# Altium schematic sheet user.SchDoc
size A3
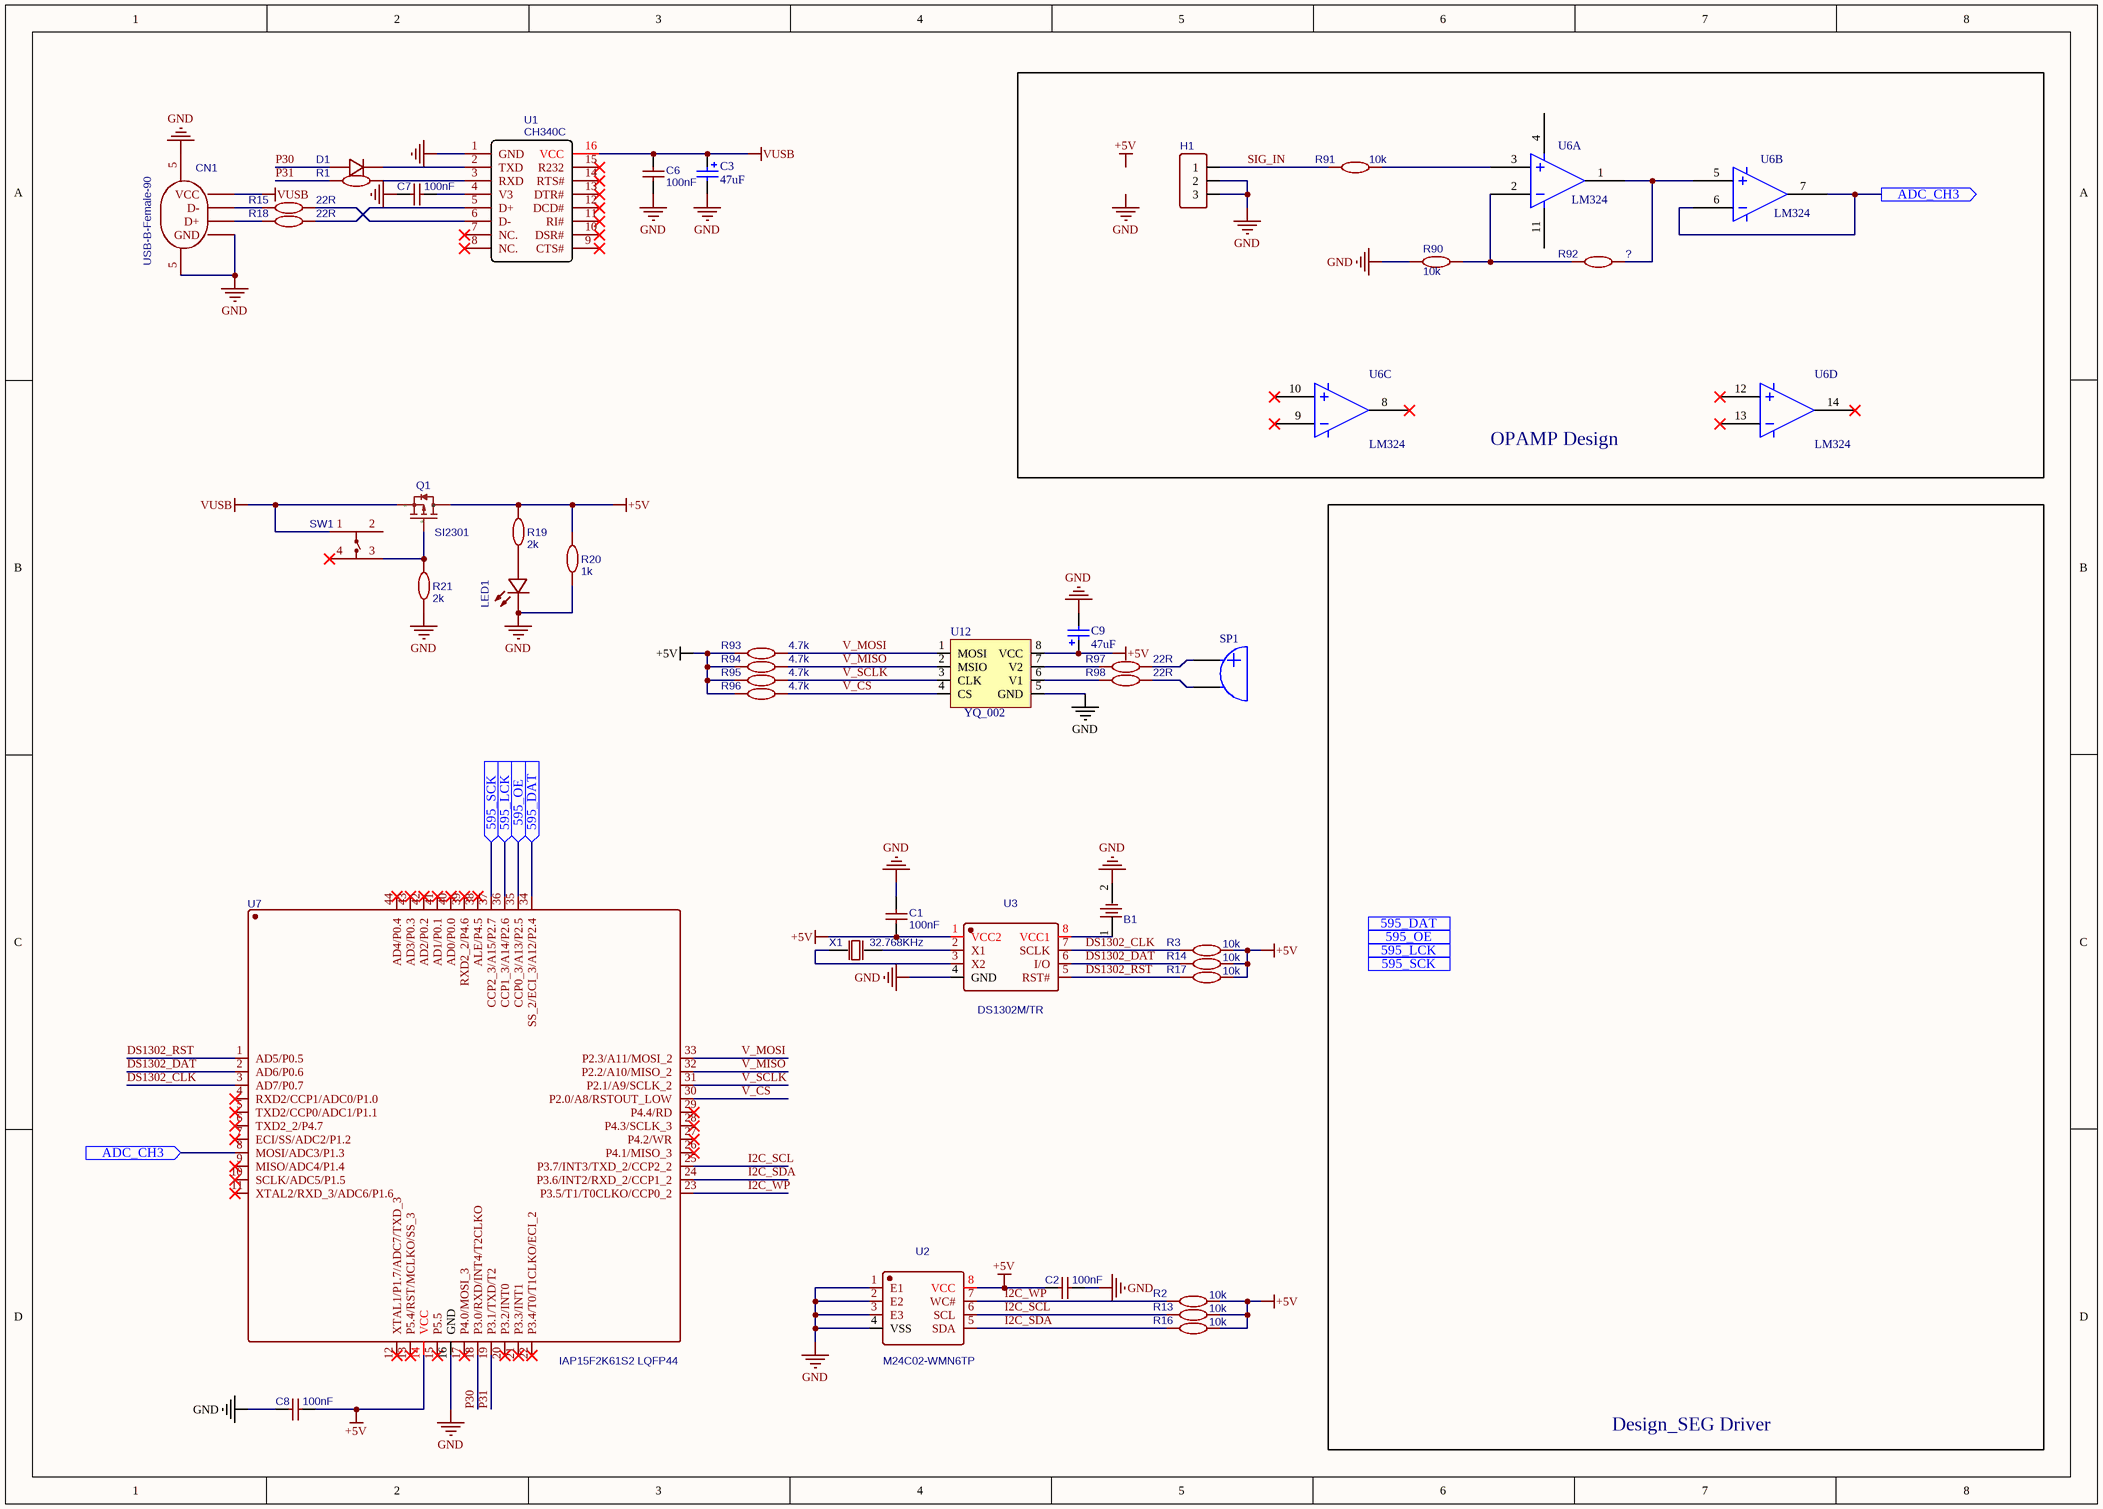
[diagram p0: user.SchDoc]

## Parts
B1  CR1220-2  (value not drawn)
C1  100nF
C2  100nF
C3  47uF
C6  100nF
C7  100nF
C8  100nF
C9  47uF
CN1  USB-B-Female-90
D1  KLL4148  (value not drawn)
H1  HDR-F-2.54_1x3  (value not drawn)
LED1  17-21URC/TR8  (value not drawn)
Q1  SI2301
R1  1k  (value not drawn)
R2  10k
R3  10k
R13  10k
R14  10k
R15  22R
R16  10k
R17  10k
R18  22R
R19  2k
R20  1k
R21  2k
R90  10k
R91  10k
R92  ?
R93  4.7k
R94  4.7k
R95  4.7k
R96  4.7k
R97  22R
R98  22R
SP1  BUZZER  (value not drawn)
SW1  TS-1159UB-B-D-BL  (value not drawn)
U1  CH340C
U2  M24C02-WMN6TP
U3  DS1302M/TR
U6  LM324  (parts A,B,C,D of 4)
U7  IAP15F2K61S2 LQFP44
U12  YQ_002
X1  32.768KHz

## Blocks framed on the sheet
OPAMP Design: H1 R90-R92 U6

## Ports
595_DAT (in), 595_DAT (out), 595_LCK (in), 595_LCK (out), 595_OE (in), 595_OE (out), 595_SCK (in), 595_SCK (out), ADC_CH3 (in), ADC_CH3 (out)

## Nets
+5V: C1.1 C2.1 C8.2 C9.1 Q1.3(D) R2.2 R3.2 R13.2 R14.2 R16.2 R17.2 R19.2 R20.2 R93.2 R94.2 R95.2 R96.2 U2.8(VCC) U3.1(VCC2) U7.14(VCC) U12.8(VCC)
GND: B1.2 C1.2 C2.2 C3.2 C6.1 C7.1 C8.1 C9.2 CN1.4(GND) CN1.5(SH1) H1.2 H1.3 LED1.2(K) R20.1 R21.1 R90.2 U1.1(GND) U2.1(E1) U2.2(E2) U2.3(E3) U2.4(VSS) U3.4(GND) U7.16(GND) U12.5(GND)
VUSB: C3.1 C6.2 CN1.1(VCC) Q1.2(S) SW1.1 U1.16(VCC)
595_DAT: U7.34(SS_2/ECI_3/A12/P2.4) ; port 595_DAT
595_LCK: U7.36(CCP1_3/A14/P2.6) ; port 595_LCK
595_OE: U7.35(CCP0_3/A13/P2.5) ; port 595_OE
595_SCK: U7.37(CCP2_3/A15/P2.7) ; port 595_SCK
ADC_CH3: U6.6 U6.7 U7.8(MOSI/ADC3/P1.3) ; port ADC_CH3
DS1302_CLK: R3.1 U3.7(SCLK) U7.3(AD7/P0.7)
DS1302_DAT: R14.1 U3.6(I/O) U7.2(AD6/P0.6)
DS1302_RST: R17.1 U3.5(RST#) U7.1(AD5/P0.5)
I2C_SCL: R13.1 U2.6(SCL) U7.25(P3.7/INT3/TXD_2/CCP2_2)
I2C_SDA: R16.1 U2.5(SDA) U7.24(P3.6/INT2/RXD_2/CCP1_2)
I2C_WP: R2.1 U2.7(WC#) U7.23(P3.5/T1/T0CLKO/CCP0_2)
P30: D1.2(A) U7.18(P3.0/RXD/INT4/T2CLKO)
P31: R1.2 U7.19(P3.1/TXD/T2)
SIG_IN: H1.1 R91.2
V_CS: R96.1 U7.30(P2.0/A8/RSTOUT_LOW) U12.4(CS)
V_MISO: R94.1 U7.32(P2.2/A10/MISO_2) U12.2(MSIO)
V_MOSI: R93.1 U7.33(P2.3/A11/MOSI_2) U12.1(MOSI)
V_SCLK: R95.1 U7.31(P2.1/A9/SCLK_2) U12.3(CLK)
NetB1_1: B1.1 U3.8(VCC1)
NetC7_2: C7.2 U1.4(V3)
NetCN1_2: CN1.2(D-) R15.2
NetCN1_3: CN1.3(D+) R18.2
NetD1_1: D1.1(C) U1.2(TXD)
NetLED1_1: LED1.1(A) R19.1
NetQ1_1: Q1.1(G) R21.2 SW1.3
NetR1_1: R1.1 U1.3(RXD)
NetR15_1: R15.1 U1.6(D-)
NetR18_1: R18.1 U1.5(D+)
NetR90_1: R90.1 R92.2 U6.2
NetR91_1: R91.1 U6.3
NetR92_1: R92.1 U6.1 U6.5
NetR97_1: R97.1 U12.7(V2)
NetR97_2: R97.2 SP1.1
NetR98_1: R98.1 U12.6(V1)
NetR98_2: R98.2 SP1.2
NetU3_2: U3.2(X1) X1.2(OSC2)
NetU3_3: U3.3(X2) X1.1(OSC1)

Not connected (* = marked no-connect by the designer): SW1 2 4*; U1 7(NC.)* 8(NC.)* 9(CTS#)* 10(DSR#)* 11(RI#)* 12(DCD#)* 13(DTR#)* 14(RTS#)* 15(R232)*; U6 4 8* 9* 10* 11 12* 13* 14*; U7 4(RXD2/CCP1/ADC0/P1.0)* 5(TXD2/CCP0/ADC1/P1.1)* 6(TXD2_2/P4.7)* 7(ECI/SS/ADC2/P1.2)* 9(MISO/ADC4/P1.4)* 10(SCLK/ADC5/P1.5)* 11(XTAL2/RXD_3/ADC6/P1.6)* 12(XTAL1/P1.7/ADC7/TXD_3)* 13(P5.4/RST/MCLKO/SS_3)* 15(P5.5)* 17(P4.0/MOSI_3)* 20(P3.2/INT0)* 21(P3.3/INT1)* 22(P3.4/T0/T1CLKO/ECI_2)* 26(P4.1/MISO_3)* 27(P4.2/WR)* 28(P4.3/SCLK_3)* 29(P4.4/RD)* 38(ALE/P4.5)* 39(RXD2_2/P4.6)* 40(AD0/P0.0)* 41(AD1/P0.1)* 42(AD2/P0.2)* 43(AD3/P0.3)* 44(AD4/P0.4)*

## Notes on the sheet
- Design_SEG Driver
- Labels drawn without touching a wire or pin: +5V, GND

## Library data of the parts
B1 = CR1220-2: BOM_Manufacturer: Q&J; BOM_Supplier: LCSC; BOM_Manufacturer Part: CR1220-2; image: //image.lceda.cn/szlcsc/C70381.jpg; BOM_Supplier Part: C70381; spicePre: B; spiceSymbolName: CR1220-2
C1 C2 C6-C8 = 100nF: BOM_Manufacturer: FH; BOM_Manufacturer Part: 0805F104M500NT; nameAlias: Capacitance; BOM_Supplier: LCSC; BOM_Supplier Part: C28378; spicePre: C; spiceSymbolName: 0805F104M500NT
C3 C9 = Cap Pol2: Polarized Capacitor (Axial)
CN1 = USB-B-Female-90: BOM_Manufacturer: ValuePro; BOM_Manufacturer Part: USB-BF90; BOM_Supplier: LCSC; image: //image.lceda.cn/szlcsc/C46392.jpg; BOM_Supplier Part: C46392; spicePre: C; spiceSymbolName: USB-B-Female-90
D1 = KLL4148: BOM_Manufacturer: KEXIN; Contributor: LCSC; BOM_Supplier: LCSC; BOM_Supplier Part: C369941; BOM_Manufacturer Part: KLL4148; spicePre: D; spiceSymbolName: KLL4148
H1 = HDR-F-2.54_1x3: Contributor: LCEDA_Lib; BOM_Supplier Part: C146690; BOM_Supplier: LCSC; spicePre: H; spiceSymbolName: HDR-F-2.54_1x3
LED1 = 17-21URC/TR8: BOM_Manufacturer: Everlight Elec; Contributor: LCSC; BOM_Supplier: LCSC; BOM_Supplier Part: C264414; BOM_Manufacturer Part: 17-21URC/TR8; spicePre: L; spiceSymbolName: 17-21URC/TR8
Q1 = SI2301: BOM_Manufacturer: Hottech; Contributor: LCSC; SMT Type: Extend; BOM_Supplier: LCSC; BOM_Manufacturer Part: SI2301; BOM_Supplier Part: C181086; BOM_LCSC Assembly: Yes; spicePre: Q; spiceSymbolName: SI2301
R1 R15 R18 R20 R90-R98 = 1k: BOM_Manufacturer: UniOhm; BOM_Manufacturer Part: 080500J0104T5E; nameAlias: Resistance (Ohms); Contributor: LCSC; BOM_Supplier: LCSC; BOM_Supplier Part: C149503; spicePre: R; spiceSymbolName: 080500J0104T5E
R2 R3 R13 R14 R16 R17 = 10k: BOM_Manufacturer: UniOhm; BOM_Manufacturer Part: 080500J0104T5E; nameAlias: Resistance (Ohms); Contributor: LCSC; BOM_Supplier: LCSC; BOM_Supplier Part: C149503; spicePre: R; spiceSymbolName: 080500J0104T5E
R19 R21 = 2k: BOM_Manufacturer: UniOhm; BOM_Manufacturer Part: 080500J0104T5E; nameAlias: Resistance (Ohms); Contributor: LCSC; BOM_Supplier: LCSC; BOM_Supplier Part: C149503; spicePre: R; spiceSymbolName: 080500J0104T5E
SW1 = TS-1159UB-B-D-BL: BOM_Manufacturer: XKB Connectivity; Contributor: LCSC; BOM_Supplier: LCSC; BOM_Supplier Part: C692480; BOM_Manufacturer Part: TS-1159UB-B-D-BL; spicePre: S; spiceSymbolName: TS-1159UB-B-D-BL
U1 = CH340C: BOM_Manufacturer: WCH; SMT Type: Extend; BOM_Supplier: LCSC; BOM_Manufacturer Part: CH340C; BOM_Supplier Part: C84681; BOM_LCSC Assembly: Yes; spicePre: U; spiceSymbolName: CH340C
U2 = M24C02-WMN6TP: BOM_Manufacturer: STMicroelectronics; SMT Type: Basic; spicePre: X; BOM_Supplier: LCSC; BOM_Manufacturer Part: M24C02-WMN6TP; BOM_LCSC Assembly: Yes; image: //image.lceda.cn/szlcsc/C7562.jpg; BOM_Supplier Part: C7562; spiceSymbolName: M24C02-WMN6TP
U3 = DS1302M/TR: BOM_Manufacturer: HGSEMI; Contributor: LCSC; BOM_Supplier: LCSC; BOM_Supplier Part: C434511; BOM_Manufacturer Part: DS1302M/TR; spicePre: U; spiceSymbolName: DS1302M/TR
U6 = LM124
U7 = IAP15F2K61S2 LQFP44: BOM_Manufacturer: STC; SMT Type: Extend; BOM_Supplier: LCSC; BOM_Manufacturer Part: IAP15F2K61S2 LQFP44; BOM_Supplier Part: C47451; BOM_LCSC Assembly: Yes; spicePre: U; spiceSymbolName: IAP15F2K61S2 LQFP44
U12 = LQ2021
X1 = 32.768KHz: BOM_Manufacturer: SHENZHEN CRYSTAL TECH; BOM_Manufacturer Part: 6K832768F12UB; nameAlias: Frequency; Contributor: LCSC; BOM_Supplier: LCSC; BOM_Supplier Part: C252404; spicePre: X; spiceSymbolName: 6K832768F12UB